# Altium schematic sheet Control.schdoc: EGB220_ControlBoard
size A3
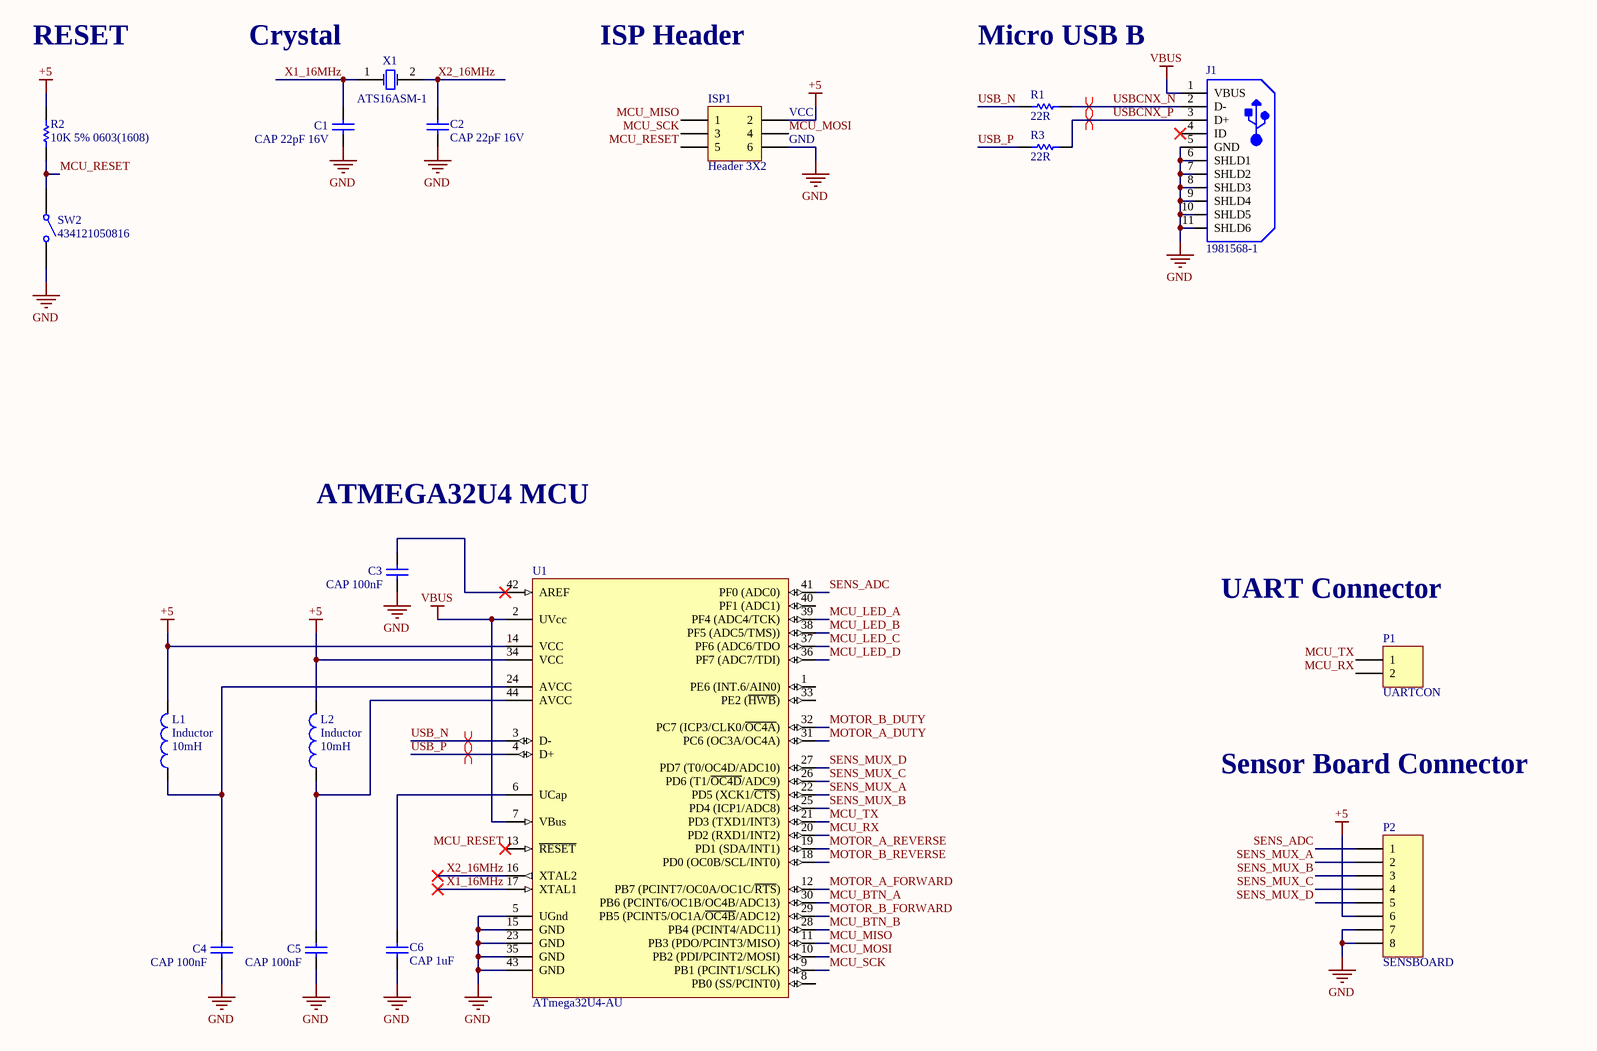
[diagram p0: Control.schdoc]

## Parts
C1  CAP 22pF 16V  [CAPC0603(1608)100_N]
C2  CAP 22pF 16V  [CAPC0603(1608)100_N]
C3  CAP 100nF  [CAPC0603(1608)100_M]
C4  CAP 100nF  [CAPC0603(1608)100_M]
C5  CAP 100nF  [CAPC0603(1608)100_M]
C6  CAP 1uF  [CAPC0603(1608)100_L]
ISP1  Header 3X2  [HDR2X3]
J1  1981568-1  [TECO-1981568-5_V]
L1  Inductor  value 10mH  [0603]
L2  Inductor  value 10mH  [0603]
P1  UARTCON  [HDR1X2]
P2  SENSBOARD  [HDR1X8]
R1  22R  [RESC0603(1608)_N]
R2  10K 5% 0603(1608)  [RESC0603(1608)_N]
R3  22R  [RESC0603(1608)_N]
SW2  434121050816  [434121050816]
U1  ATmega32U4-AU  [44ML_M]
X1  ATS16ASM-1  [CTS-ATS-SM-XTAL-2]

## Nets
+5: ISP1.2 L1.2 L2.2 P2.6 R2.2 U1.14(VCC) U1.34(VCC)
GND: C1.1 C2.2 C3.1 C4.1 C5.1 C6.1 ISP1.6 J1.5(GND) J1.6(SHLD1) J1.7(SHLD2) J1.8(SHLD3) J1.9(SHLD4) J1.10(SHLD5) J1.11(SHLD6) P2.7 P2.8 SW2.2 U1.5(UGnd) U1.15(GND) U1.23(GND) U1.35(GND) U1.43(GND)
VBUS: J1.1(VBUS) U1.2(UVcc) U1.7(VBus)
MCU_BTN_A: U1.30(PB6_(PCINT6/OC1B/OC4B/ADC13))
MCU_BTN_B: U1.28(PB4_(PCINT4/ADC11))
MCU_LED_A: U1.39(PF4_(ADC4/TCK))
MCU_LED_B: U1.38(PF5_(ADC5/TMS)))
MCU_LED_C: U1.37(PF6_(ADC6/TDO)
MCU_LED_D: U1.36(PF7_(ADC7/TDI))
MCU_MISO: ISP1.1 U1.11(PB3_(PDO/PCINT3/MISO))
MCU_MOSI: ISP1.4 U1.10(PB2_(PDI/PCINT2/MOSI))
MCU_RESET: ISP1.5 R2.1 SW2.1 U1.13(~{RESET})
MCU_RX: P1.2 U1.20(PD2_(RXD1/INT2))
MCU_SCK: ISP1.3 U1.9(PB1_(PCINT1/SCLK))
MCU_TX: P1.1 U1.21(PD3_(TXD1/INT3))
MOTOR_A_DUTY: U1.31(PC6_(OC3A/OC4A))
MOTOR_A_FORWARD: U1.12(PB7_(PCINT7/OC0A/OC1C/~{RTS}))
MOTOR_A_REVERSE: U1.19(PD1_(SDA/INT1))
MOTOR_B_DUTY: U1.32(PC7_(ICP3/CLK0/~{OC4A}))
MOTOR_B_FORWARD: U1.29(PB5_(PCINT5/OC1A/~{OC4B}/ADC12))
MOTOR_B_REVERSE: U1.18(PD0_(OC0B/SCL/INT0))
SENS_ADC: P2.1 U1.41(PF0_(ADC0))
SENS_MUX_A: P2.2 U1.22(PD5_(XCK1/~{CTS}))
SENS_MUX_B: P2.3 U1.25(PD4_(ICP1/ADC8))
SENS_MUX_C: P2.4 U1.26(PD6_(T1/~{OC4D}/ADC9))
SENS_MUX_D: P2.5 U1.27(PD7_(T0/OC4D/ADC10))
USB_N: R1.1 U1.3(D-)
USB_P: R3.1 U1.4(D+)
USBCNX_N: J1.2(D-) R1.2
USBCNX_P: J1.3(D+) R3.2
X1_16MHz: C1.2 U1.17(XTAL1) X1.1(X1)
X2_16MHz: C2.1 U1.16(XTAL2) X1.2(X2)
NetC3_2: C3.2 U1.42(AREF)
NetC4_2: C4.2 L1.1 U1.24(AVCC)
NetC5_2: C5.2 L2.1 U1.44(AVCC)
NetC6_2: C6.2 U1.6(UCap)

Not connected (* = marked no-connect by the designer): J1 4(ID)*; U1 1(PE6_(INT.6/AIN0)) 8(PB0_(SS/PCINT0)) 33(PE2_(~{HWB})) 40(PF1_(ADC1))

## Layout directives
differential pair: USB_N, USB_P, USBCNX_N, USBCNX_P

## Notes on the sheet
- RESET
- Crystal
- ISP Header
- Micro USB B
- (near ISP1) VCC
- (near ISP1) GND
- ATMEGA32U4 MCU
- UART Connector
- Sensor Board Connector
- Title
- Size:
- Date:
- A3
- Number:
- Time:
- Revision:
- Sheet
- of
- File:

## Library data of the parts
C1 C2 = CMP-1035-00808-1: CAP 22pF 16V ±5% 0603 (1608 Metric) Thickness 1mm SMD; Tolerance: Â±5%; Case-EIA: 0603; Case-Metric: 1608; Technology: SMT; Value: 22pF; Rated Voltage: 16 V; Max Thickness: 1 mm
C3-C5 = CMP-1035-02583-1: CAP 100nF 16V ±5% 0603 (1608 Metric) Thickness 1mm SMD; Tolerance: Â±5%; Case-Metric: 1608; Case-EIA: 0603; Rated Voltage: 16 V; Max Thickness: 1 mm; Technology: SMT; Value: 100nF
C6 = CMP-1035-02740-1: CAP 1uF 25V ±10% 0603 (1608 Metric) Thickness 1mm SMD; Tolerance: Â±10%; Case-Metric: 1608; Case-EIA: 0603; Technology: SMT; Rated Voltage: 25 V; Max Thickness: 1 mm; Value: 1uF
ISP1 = Header 3X2: Header, 3-Pin, Dual row; LatestRevisionDate: 17-Jul-2002; LatestRevisionNote: Re-released for DXP Platform.; Publisher: Altium Limited
J1 = CMP-2000-05408-1: Micro USB Receptacle Standard Type B Assy, 5-Pin SMD, RoHS, Tape and Reel; Manufacturer: TE Connectivity; Body Orientation: RightAngle; Number of Ports: 1Port; Number of Contacts: 5POS; Gender: RCP; Voltage Rating Max: 30VAC; Product Depth (mm): 5.6mm; Pitch (mm): 0.65mm; Current Rating (Max): 1/ContactA; Product Length (mm): 8mm; Product Height (mm): 3mm; Operating Temperature Max Deg. C: 85C; Datasheet URL: http://www.mouser.com/ds/2/418/NG_CD_1981568_E2-621296.pdf; Termination Method: Solder; Number of Terminals: 5; Operating Temp Range: -55Cto85C; Mounting Style: SurfaceMount; Manufacturer URL: http://www.te.com/; Contact Material: CopperAlloy; Packaging: TapeandReel; Datasheet Version: Rev. E2, 08/2015; Operating Temperature Min Deg. C: -55C; Housing Material: Thermoplastic; Type: MicroUSB; Contact Plating: GoldOverNickel
L1 L2 = Inductor: Code_IEC: 1005; Published: 8-Jun-2000; LatestRevisionDate: 29-May-2009; LatestRevisionNote: IPC-7351 Footprint Added.; PackageReference: 0402-A; Publisher: Altium Limited; PackageDescription: Chip Inductor; Code_JEITA: 0402
P1 = Header 2: Header, 2-Pin; LatestRevisionDate: 17-Jul-2002; LatestRevisionNote: Re-released for DXP Platform.; Publisher: Altium Limited
P2 = Header 8: Header, 8-Pin; System: Connector; LatestRevisionDate: 17-Jul-2002; LatestRevisionNote: Re-released for DXP Platform.; Publisher: Altium Limited
R1 R3 = CMP-1012-00034-1: 22R 0.1W 5% 0603 (1608 Metric)  SMD; Value: 22.00 Ohm; Case-EIA: 0603; Case-Metric: 1608; Technology: SMT; Power: 0.1 W; Tolerance: 5 %
R2 = CMP-1012-00098-1: 10K 0.1W 5% 0603 (1608 Metric)  SMD; Case-EIA: 0603; Value: 10000.00 Ohm; Case-Metric: 1608; Technology: SMT; Tolerance: 5 %; Power: 0.1 W
SW2 = CMP-1459-00007-1: WS-TASV SMD Tact Switch 6.0X3.5 mm; Manufacturer: Wuerth Elektronik; NoPins: 02; ComponentLink1Description: Manufacturer URL; PackageReference: 434121050816; PartNumber: 434121050816; ComponentLink2URL: http://katalog.we-online.de/em/datasheet/434121050816.pdf; ComponentLink1URL: http://www.we-online.com; ComponentLink2Description: Datasheet
U1 = CMP-0095-00285-2: 8-bit AVR Microcontroller, 2.7-5.5V, 16MHz, 32KB Flash, 1KB EEPROM, 2.5KB SRAM, USB Controller, 44-pin TQFP, Industrial Grade (-40°C to 85°C), Ext Osc; RevisionNote: DatasheetVersion updated. URLs added.; ComponentLink1Description: Manufacturer URL; PackageDescription: 44-Pin Plastic Thin Quad Flat Pack, 10 x 10 x 1.0 mm Body, 0.8 mm Pitch (TQFP); DatasheetVersion: revF, Nov-2010; ComponentLink2URL: http://www.atmel.com/dyn/resources/prod_documents/doc7766.pdf; ComponentLink1URL: http://www.atmel.com/; PackageReference: 44ML; ComponentLink2Description: ATmega16U4/32U4 Datasheet; PackageVersion: rev.G, Jul-2007; ComponentLink3URL: http://www.atmel.com/dyn/resources/prod_documents/7766S.pdf; ComponentLink3Description: ATmega16U4 ATmega32U4 Summary
X1 = CMP-0585-00002-2: ATS-SM Series Quartz Crystal, 16 MHz, -20 to 70 degC, 11.1 x 4.83 x 4.3mm SMD, RoHS, Tape and Reel; Manufacturer: CTS Corporation; Shunt Capacitance (C0): 7.0 pF Max; Frequency: 16 MHz; Oscillation Mode: Fundamental or 3rd Overtone; Crystal Cut: AT-Cut; ESR Maximum: 40 Ohms; Drive Level (Type): 100 uW; PackageDescription: 2-Pin SMD, Body 11.1 x 4.83 mm, Pitch 8.5 mm; PackageReference: ATS-SM-XTAL-2; ComponentLink1URL: http://www.ctscorp.com/; PartNumber: ATS16ASM-1; RoHS: TRUE; ComponentLink1Description: Manufacturer URL; Operating Temperature: -20 to 70 degC; DatasheetVersion: Rev. K; ComponentLink2Description: Datasheet; Packing: Tape and Reel; ComponentLink2URL: http://www.ctscorp.com/components/Datasheets/008-0309-0.pdf; Mounting Technology: Surface Mount; ComponentLink3URL: http://www.ctscorp.com/components/Datasheets/008-0309-0.pdf; ComponentLink3Description: Package Specification